# EAGLE design Twatch v1a (EAGLE 5.07)
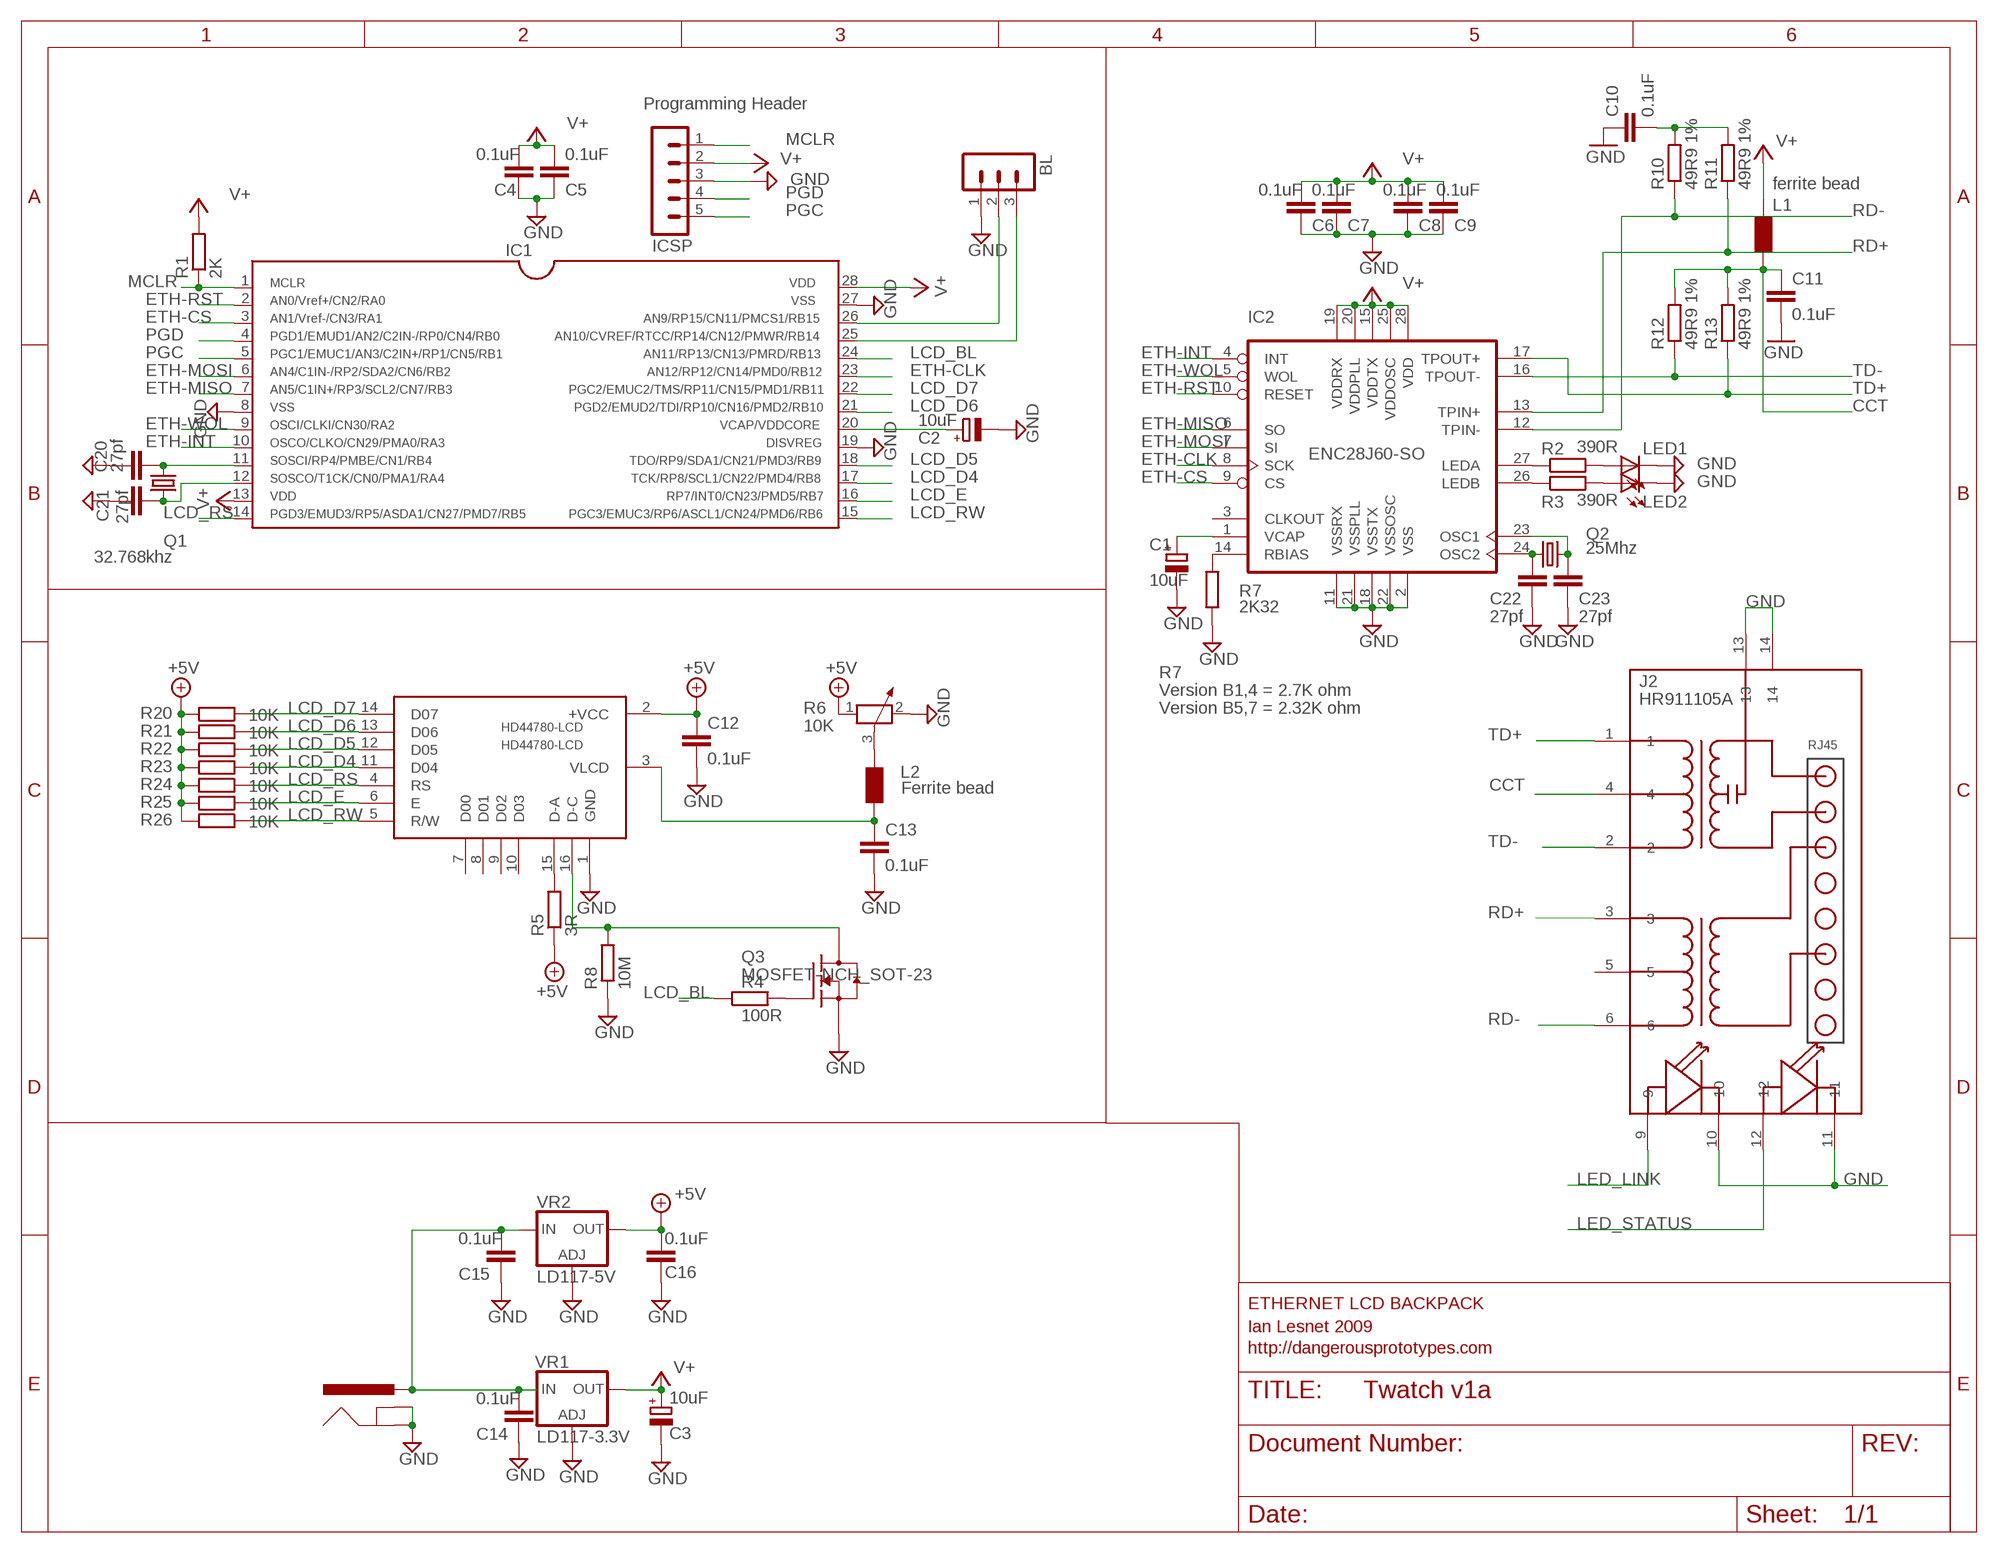
[diagram p0: schematic, sheet 1]

## Parts
BL  MA03-1  [MA03-1]
C1  10uF  CPOL-EUSMCA  [SMC_A]
C2  10uF  CPOL-EUSMCA  [SMC_A]
C3  10uF  CPOL-EUSMCA  [SMC_A]
C4  0.1uF  C-EUC0805  [C0805]
C5  0.1uF  C-EUC0805  [C0805]
C6  0.1uF  C-EUC0805  [C0805]
C7  0.1uF  C-EUC0805  [C0805]
C8  0.1uF  C-EUC0805  [C0805]
C9  0.1uF  C-EUC0805  [C0805]
C10  0.1uF  C-EUC0805  [C0805]
C11  0.1uF  C-EUC0805  [C0805]
C12  0.1uF  C-EUC0805  [C0805]
C13  0.1uF  C-EUC0805  [C0805]
C14  0.1uF  C-EUC0805  [C0805]
C15  0.1uF  C-EUC0805  [C0805]
C16  0.1uF  C-EUC0805  [C0805]
C20  27pf  C-EUC0805  [C0805]
C21  27pf  C-EUC0805  [C0805]
C22  27pf  C-EUC0805  [C0805]
C23  27pf  C-EUC0805  [C0805]
HD44780-LCD  HD44780-LCD  [HD44780]
IC1  PIC24FJ64GA002  [SO28W]
IC2  ENC28J60-SO  [SO28W]
ICSP  MA05-1  [MA05-1]
J1  POWER_JACKSMD  [POWER_JACK_SMD]
J2  HR911105A  [HR911105A]
L1  ferrite bead  WE-KIL_0805  [WE-KI_0805_B]
L2  Ferrite bead  WE-KIL_0805  [WE-KI_0805_B]
LED1  LEDCHIPLED_0805  [LED0805]
LED2  LEDCHIPLED_0805  [LED0805]
Q1  32.768khz  CRYSTALMM20SS  [MM20SS]
Q2  25Mhz  CRYSTALHC49UP  [HC49UP]
Q3  MOSFET-NCH_SOT-23  [SOT95P280X135-3N]
R1  2K  R-EU_R0805  [R0805]
R2  390R  R-EU_R0805  [R0805]
R3  390R  R-EU_R0805  [R0805]
R4  100R  R-EU_R0805  [R0805]
R5  3R  R-EU_R0805  [R0805]
R6  10K  POTENTIOMETER_PT-10  [PT-10]
R7  2K32  R-EU_R0805  [R0805]
R8  10M  R-EU_R0805  [R0805]
R10  49R9 1%  R-EU_R0805  [R0805]
R11  49R9 1%  R-EU_R0805  [R0805]
R12  49R9 1%  R-EU_R0805  [R0805]
R13  49R9 1%  R-EU_R0805  [R0805]
R20  10K  R-EU_R0805  [R0805]
R21  10K  R-EU_R0805  [R0805]
R22  10K  R-EU_R0805  [R0805]
R23  10K  R-EU_R0805  [R0805]
R24  10K  R-EU_R0805  [R0805]
R25  10K  R-EU_R0805  [R0805]
R26  10K  R-EU_R0805  [R0805]
VR1  LD117-3.3V  LD117AS12TR  [SOT223]
VR2  LD117-5V  LD117AS12TR  [SOT223]

## Nets
+5V: C12.1 C16.1 HD44780-LCD.2(+VCC) R5.1 R6.1 R20.2 R21.2 R22.2 R23.2 R24.2 R25.2 R26.2 VR2.4(OUT)
CCT: C11.1 J2.4 L1.2 R12.2 R13.2
ETH-CLK: IC1.23 IC2.8(SCK)
ETH-CS: IC1.3 IC2.9(CS)
ETH-INT: IC1.10 IC2.4(INT)
ETH-MISO: IC1.7 IC2.6(SO)
ETH-MOSI: IC1.6 IC2.7(SI)
ETH-RST: IC1.2 IC2.10(RESET)
ETH-WOL: IC1.9 IC2.5(WOL)
GND: BL.1 C1.- C2.- C3.- C4.2 C5.2 C6.2 C7.2 C8.2 C9.2 C10.1 C11.2 C12.2 C13.2 C14.2 C15.2 C16.2 C20.2 C21.2 C22.2 C23.2 HD44780-LCD.1(GND) IC1.8 IC1.19 IC1.27 IC2.2(VSS) IC2.11(VSSRX) IC2.18(VSSTX) IC2.21(VSSPLL) IC2.22(VSSOSC) ICSP.3 J1.GND(GNDBREAK) J1.P$4(GND) J2.10 J2.11 J2.13 J2.14 LED1.C LED2.C Q3.2(S) R6.2 R7.1 R8.1 VR1.1(ADJ) VR2.1(ADJ)
LCD_BL: IC1.24 R4.1
LCD_D4: HD44780-LCD.11(D04) IC1.17 R23.1
LCD_D5: HD44780-LCD.12(D05) IC1.18 R22.1
LCD_D6: HD44780-LCD.13(D06) IC1.21 R21.1
LCD_D7: HD44780-LCD.14(D07) IC1.22 R20.1
LCD_E: HD44780-LCD.6(E) IC1.16 R25.1
LCD_RS: HD44780-LCD.4(RS) IC1.14 R24.1
LCD_RW: HD44780-LCD.5(R/W) IC1.15 R26.1
LED_LINK: J2.9
LED_STATUS: J2.12
MCLR: IC1.1 ICSP.1 R1.1
N$1: C21.1 IC1.12 Q1.4
N$2: IC2.27(LEDA) R2.1
N$3: LED1.A R2.2
N$4: IC2.26(LEDB) R3.1
N$5: C20.1 IC1.11 Q1.1
N$6: C1.+ IC2.1(VCAP)
N$7: IC2.14(RBIAS) R7.2
N$8: C2.+ IC1.20
N$9: C22.1 IC2.24(OSC2) Q2.1
N$11: L2.1 R6.3
N$12: C23.1 IC2.23(OSC1) Q2.2
N$13: LED2.A R3.2
N$14: BL.2 IC1.26
N$15: BL.3 IC1.25
N$17: C13.1 HD44780-LCD.3(VLCD) L2.2
N$18: HD44780-LCD.15(D-A) R5.2
N$19: Q3.1(G) R4.2
N$20: HD44780-LCD.16(D-C) Q3.3(D) R8.2
N$22: C10.2 R10.2 R11.2
PGC: IC1.5 ICSP.5
PGD: IC1.4 ICSP.4
RD+: IC2.13(TPIN+) J2.3 R11.1
RD-: IC2.12(TPIN-) J2.6 R10.1
TD+: IC2.17(TPOUT+) J2.1 R13.1
TD-: IC2.16(TPOUT-) J2.2 R12.1
V+: C3.+ C4.1 C5.1 C6.1 C7.1 C8.1 C9.1 IC1.13 IC1.28 IC2.15(VDDTX) IC2.19(VDDRX) IC2.20(VDDPLL) IC2.25(VDDOSC) IC2.28(VDD) ICSP.2 L1.1 R1.2 VR1.4(OUT)
VBAT: C14.1 C15.1 J1.VIN0(PWR) VR1.3(IN) VR2.3(IN)
Unconnected: HD44780-LCD.7(D00) HD44780-LCD.8(D01) HD44780-LCD.9(D02) HD44780-LCD.10(D03) IC2.3(CLKOUT) J2.5

## Notes on the sheet
- Programming Header
- R7
- Version B1,4 = 2.7K ohm
- Version B5,7 = 2.32K ohm
- ETHERNET LCD BACKPACK
- Ian Lesnet 2009
- http://dangerousprototypes.com

## Library data of the parts
BL = con-lstb:MA03-1: PIN HEADER
C1-C3 = rcl:CPOL-EU: POLARIZED CAPACITOR, European symbol
C4-C16 C20-C23 = rcl:C-EU: CAPACITOR, European symbol
HD44780-LCD = lcd-hd44780:HD44780-LCD
IC1 = microchip-pic24:PIC24FJ64GA002
IC2 = microchip-enc28j60:ENC28J60-*: Microchip 10Mbit Eth. contoller with SPI interface
ICSP = con-lstb:MA05-1: PIN HEADER
J1 = SparkFun:POWER_JACK: Power Jack This is the standard 5.5mm barrel jack for power. The PTH is the most common, proven, reliable, footprint. All others are experimental. The Slot footprint only works if the mill layer is transmitted to the PCB fab house so be warned. Spark Fun Electronics SKU : PRT-00119. Mating wall wart : TOL-00298 (and others)
J2 = CONNECTER:HR911105A
L1 L2 = wuerth-elektronik:WE-KIL: SMD Wire Wound Ceramic Inductor WE-KIL - Low profile - High Q values -- Bluetooth -- Wireless LAN -- RF oscillation circuit -- IF impedance matching
LED1 LED2 = led:LED: LED OSRAM: - CHIPLED LG R971, LG N971, LY N971, LG Q971, LY Q971, LO R971, LY R971 LH N974, LH R974 LS Q976, LO Q976, LY Q976 LO Q996 - Hyper CHIPLED LW Q18S LB Q993, LB Q99A, LB R99A - SideLED LS A670, LO A670, LY A670, LG A670, LP A670 LB A673, LV A673, LT A673, LW A673 LH A674 LY A675 LS A676, LA A676, LO A676, LY A676, LW A676 LS A679, LY A679, LG A679 - Hyper Micro SIDELED® LS Y876, LA Y876, LO Y876, LY Y876 LT Y87S - SmartLED LW L88C, LW L88S LB L89C, LB L89S, LG L890 LS L89K, LO L89K, LY L89K LS L896, LA L896, LO L896, LY L896 - TOPLED LS T670, LO T670, LY T670, LG T670, LP T670 LSG T670, LSP T670, LSY T670, LOP T670, LYG T670 LG T671, LOG T671, LSG T671 LB T673, LV T673, LT T673, LW T673 LH T674 LS T676, LA T676, LO T676, LY T676, LB T676, LH T676, LSB T676, LW T676 LB T67C, LV T67C, LT T67C, LS T67K, LO T67K, LY T67K, LW E67C LS E67B, LA E67B, LO E67B, LY E67B, LB E67C, LV E67C, LT E67C LW T67C LS T679, LY T679, LG T679 LS T770, LO T770, LY T770, LG T770, LP T770 LB T773, LV T773, LT T773, LW T773 LH T774 LS E675, LA E675, LY E675, LS T675 LS T776, LA T776, LO T776, LY T776, LB T776 LHGB T686 LT T68C, LB T68C - Hyper Mini TOPLED® LB M676 - Mini TOPLED Santana® LG M470 LS M47K, LO M47K, LY M47K Source: http://www.osram.convergy.de - LUMILED® LXK2-PW12-R00, LXK2-PW12-S00, LXK2-PW14-U00, LXK2-PW14-V00 LXK2-PM12-R00, LXK2-PM12-S00, LXK2-PM14-U00 LXK2-PE12-Q00, LXK2-PE12-R00, LXK2-PE12-S00, LXK2-PE14-T00, LXK2-PE14-U00 LXK2-PB12-K00, LXK2-PB12-L00, LXK2-PB12-M00, LXK2-PB14-N00, LXK2-PB14-P00, LXK2-PB14-Q00 LXK2-PR12-L00, LXK2-PR12-M00, LXK2-PR14-Q00, LXK2-PR14-R00 LXK2-PD12-Q00, LXK2-PD12-R00, LXK2-PD12-S00 LXK2-PH12-R00, LXK2-PH12-S00 LXK2-PL12-P00, LXK2-PL12-Q00, LXK2-PL12-R00 Source: www.luxeon.com
Q1 Q2 = crystal:CRYSTAL: CRYSTAL
Q3 = ipc-7351-transistor:MOSFET-NCH_
R1-R5 R7 R8 R10-R13 R20-R26 = rcl:R-EU_: RESISTOR, European symbol
R6 = rcl:POTENTIOMETER_: Potentiometer
VR1 VR2 = v-reg:LD117A?*: Low drop fixed and adjustable positive voltage regulators 1 A Source: http://www.st.com/stonline/products/literature/ds/7194/ld1117axx.pdf

## Board
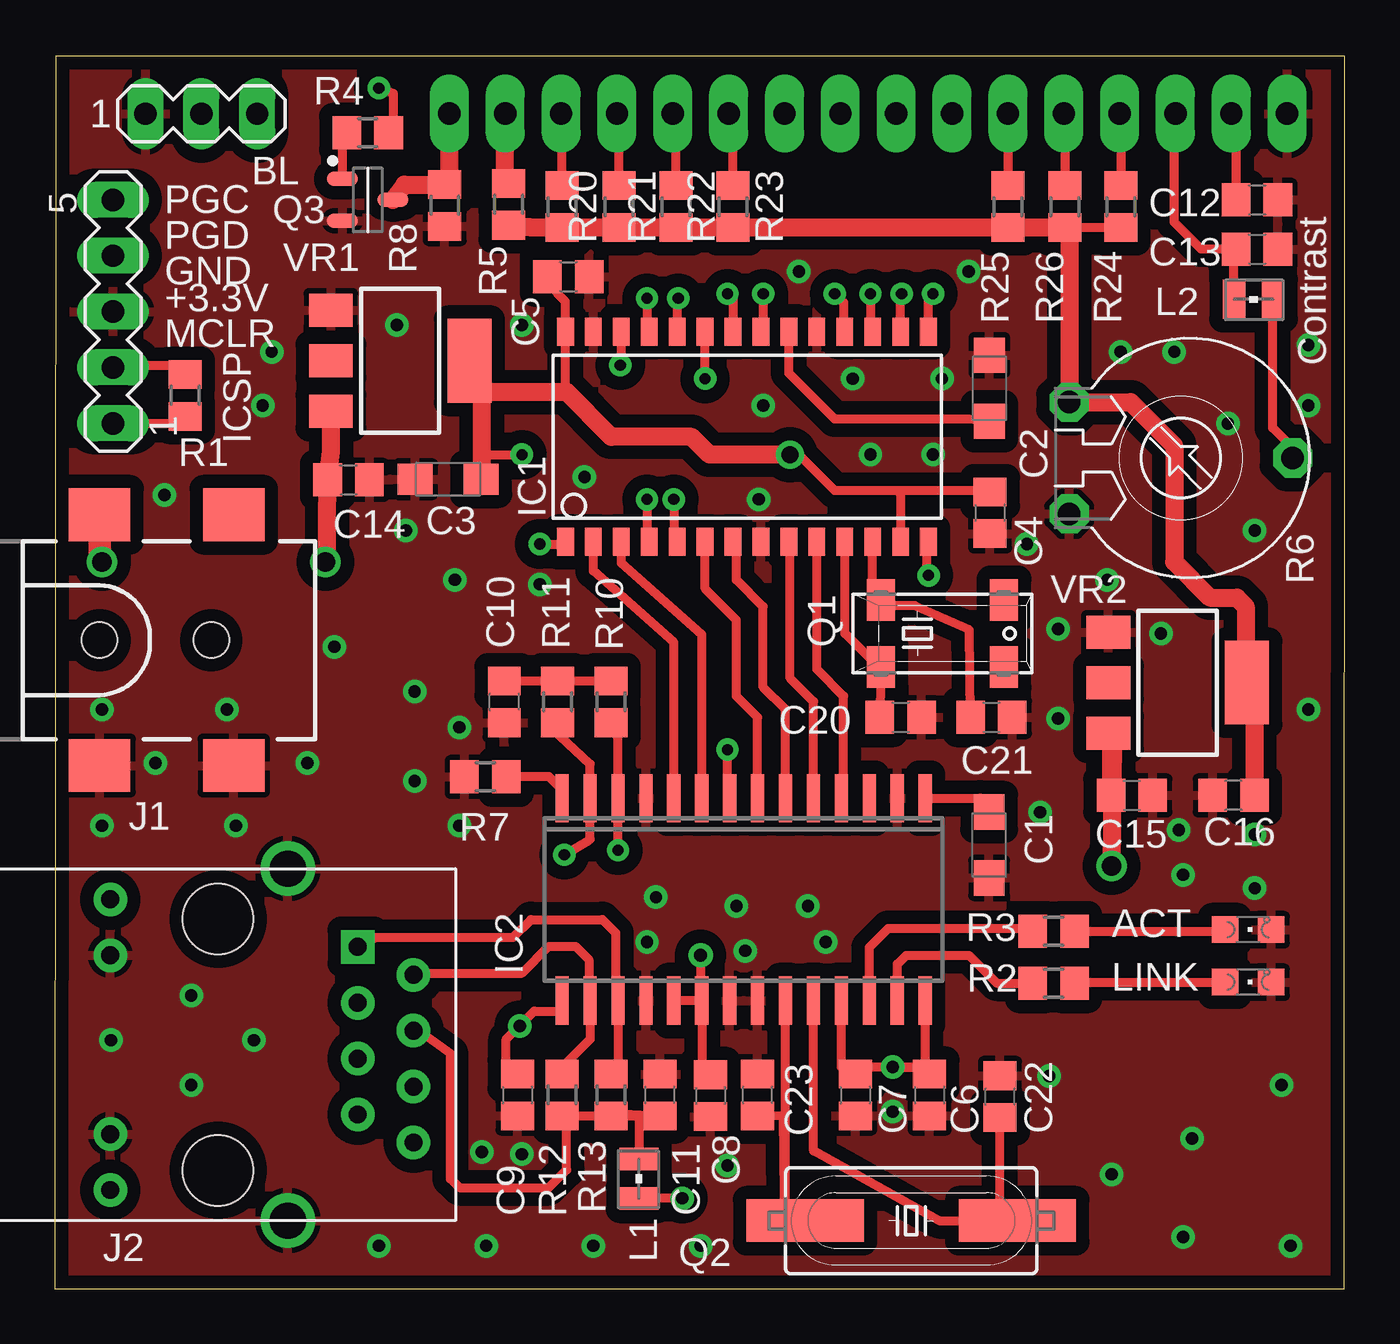
[diagram p1: board, top side]
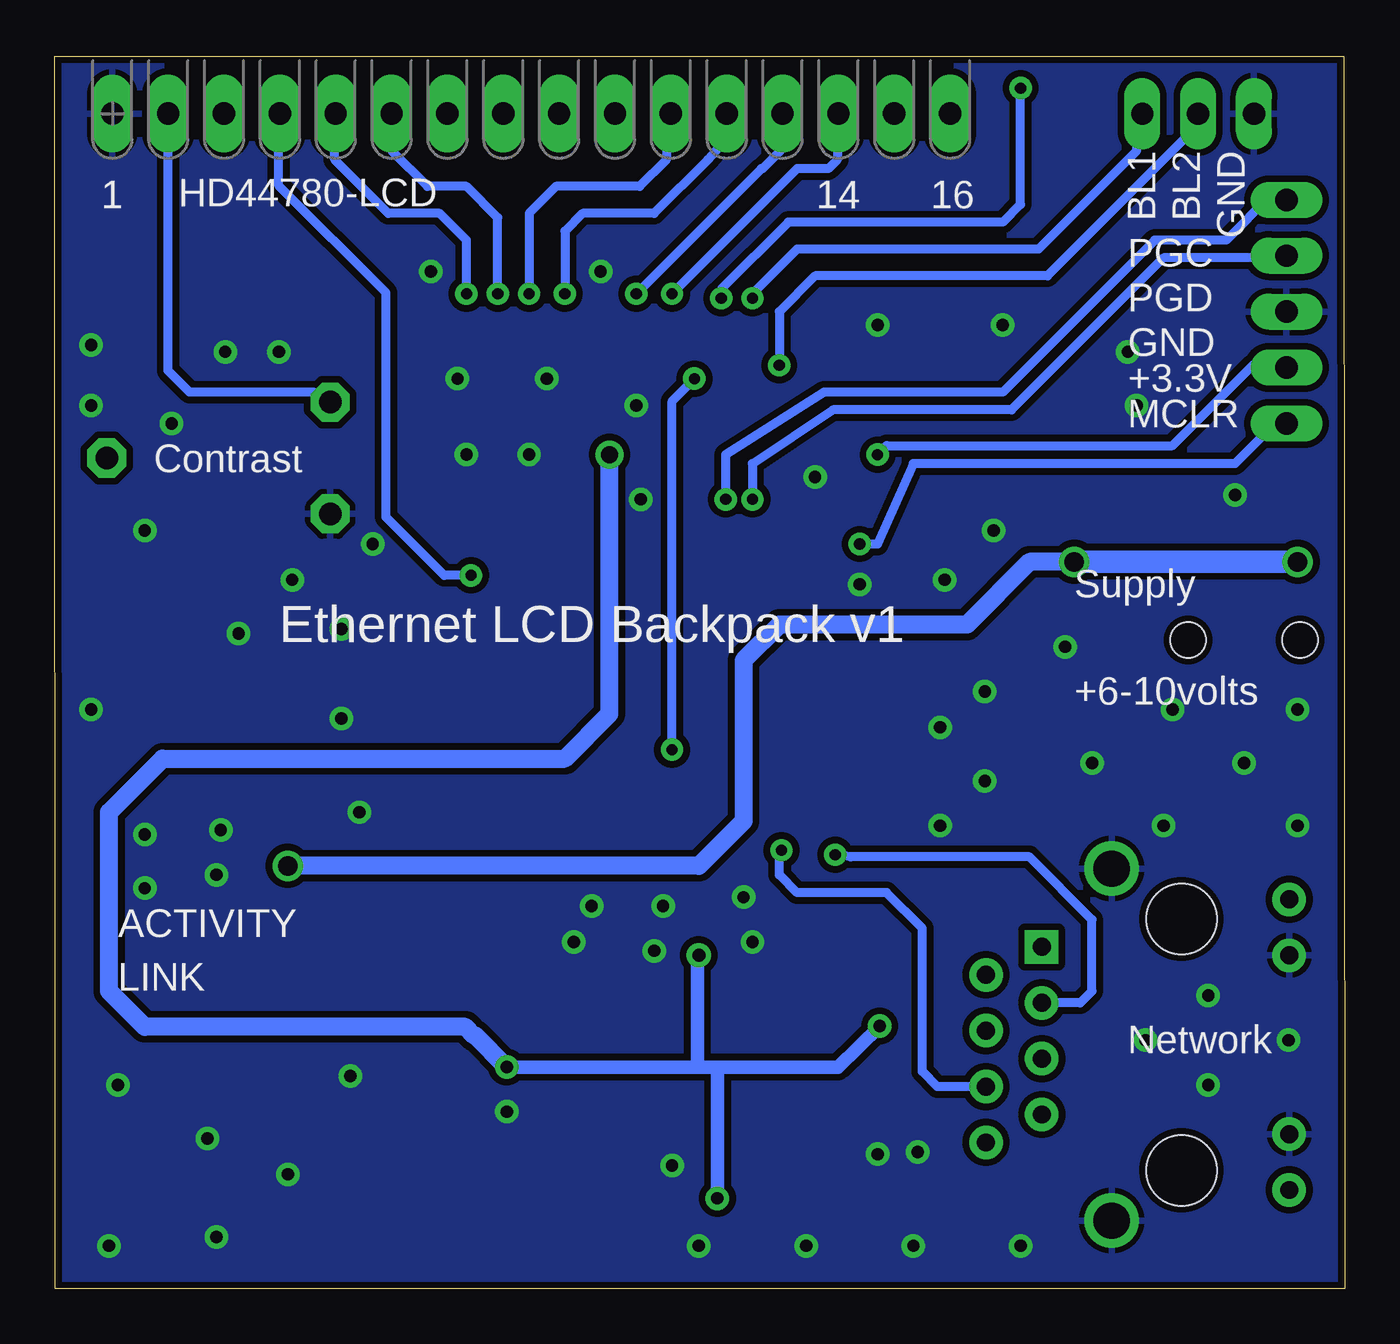
[diagram p2: board, bottom side, seen from below]

Size 58.64 x 56.02 mm. Coordinates in mm from the lower left corner, seen from the top.
Outline: 0,0 58.64,0 58.64,56.02 0.04,56.02 0,0
Copper layers (1*16): Top 0.035mm / dielectric 1.5mm / Bottom 0.035mm
Design rules "SparkFun": minimum track width 8mil, minimum drill 20mil, track to track 8mil, track to pad 8mil, pad to pad 8mil, via to via 8mil, smd to smd 8mil, copper to edge 10mil, drill to drill 8mil, minimum pad ring 12mil, minimum via ring 10mil, stop-mask expansion 4mil, vias tented up to drill 25mil, thermal gap 10mil

### Footprints (pad centres in the part's own frame; a part is rotated, then mirrored left to right if it is on the bottom)
MA03-1 = drill 1.016 long: 1 -2.54,0; 2 0,0; 3 2.54,0
SMC_A = smd 1.6 x 1.4: + -1.5,0; - 1.5,0
C0805 = smd 1.3 x 1.5: 1 -0.95,0; 2 0.95,0
HD44780 = drill 1.016 pad 1.778 long: 1 -20.325,0.007; 2 -17.785,0.007; 3 -15.245,0.007; 4 -12.705,0.007; 5 -10.165,0.007; 6 -7.625,0.007; 7 -5.085,0.007; 8 -2.545,0.007; 9 -0.005,0.007; 10 2.535,0.007; 11 5.075,0.007; 12 7.615,0.007; 13 10.155,0.007; 14 12.695,0.007; 15 15.235,0.007; 16 17.775,0.007
SO28W = smd 0.762 x 1.27: 1 -8.89,-4.78; 2 -7.62,-4.78; 3 -6.35,-4.78; 4 -5.08,-4.78; 5 -3.81,-4.78; 6 -2.54,-4.78; 7 -1.27,-4.78; 8 0,-4.78; 9 1.27,-4.78; 10 2.54,-4.78; 11 3.81,-4.78; 12 5.08,-4.78; 13 6.35,-4.78; 14 7.62,-4.78; 15 7.62,4.78; 16 6.35,4.78; 17 5.08,4.78; 18 3.81,4.78; 19 2.54,4.78; 20 1.27,4.78; 21 0,4.78; 22 -1.27,4.78; 23 -2.54,4.78; 24 -3.81,4.78; 25 -5.08,4.78; 26 -6.35,4.78; 27 -7.62,4.78; 28 -8.89,4.78
SO28W' = smd 0.6 x 2.2: 1 -8.255,-4.6; 2 -6.985,-4.6; 3 -5.715,-4.6; 4 -4.445,-4.6; 5 -3.175,-4.6; 6 -1.905,-4.6; 7 -0.635,-4.6; 8 0.635,-4.6; 9 1.905,-4.6; 10 3.175,-4.6; 11 4.445,-4.6; 12 5.715,-4.6; 13 6.985,-4.6; 14 8.255,-4.6; 15 8.255,4.6; 16 6.985,4.6; 17 5.715,4.6; 18 4.445,4.6; 19 3.175,4.6; 20 1.905,4.6; 21 0.635,4.6; 22 -0.635,4.6; 23 -1.905,4.6; 24 -3.175,4.6; 25 -4.445,4.6; 26 -5.715,4.6; 27 -6.985,4.6; 28 -8.255,4.6
MA05-1 = drill 1.016 long: 1 -5.08,0; 2 -2.54,0; 3 0,0; 4 2.54,0; 5 5.08,0
POWER_JACK_SMD = smd 2.8 x 2.4: GND 0,-5.7; P$4 6.1,-5.7; VIN0 0,5.7; VIN1 6.1,5.7 | hole 1.6: 0,0; 5.08,0
HR911105A = drill 0.813 pad 1.524 square: 1 4.445,-6.35 | drill 0.813 pad 1.524 round: 2 3.175,-8.89; 3 1.905,-6.35; 4 0.635,-8.89; 5 -0.635,-6.35; 6 -1.905,-8.89; 7 -3.175,-6.35; 8 -4.445,-8.89; 9 6.604,4.902; 10 4.064,4.902; 11 -4.064,4.902; 12 -6.604,4.902 | drill 1.651 pad 2.159 round: 13 8.001,-3.175; 14 -8.001,-3.175 | hole 3.2: 5.715,0; -5.715,0
WE-KI_0805_B = smd 1.02 x 1.78: 1 -0.89,0; 2 0.89,0
LED0805 = smd 1.2 x 1.2: A 0,-1.05; C 0,1.05
MM20SS = smd 1.27 x 1.88: 1 -2.794,-1.524; 2 2.794,-1.524; 3 2.794,1.524; 4 -2.794,1.524
HC49UP = smd 5.334 x 1.93: 1 -4.826,0; 2 4.826,0
SOT95P280X135-3N = smd 1.4 x 0.65: 1 -1.15,0.95; 2 -1.15,-0.95; 3 1.15,0
R0805 = smd 1.3 x 1.5: 1 -0.95,0; 2 0.95,0
PT-10 = drill 1.016 pad 1.778 octagon: 1 -2.54,-5.08; 2 2.54,-5.08; 3 0,5.08
SOT223 = smd 1.5 x 2: 1 -2.3,-3.15; 2 0,-3.15; 3 2.3,-3.15 | smd 3.8 x 2: 4 0,3.15

### Placement (x,y rotation side)
BL  6.65,53.41 0 top
C1  42.48,20.18 270 top
C2  42.49,40.94 90 top
C3  17.88,36.8 180 top
C4  42.52,35.28 270 top
C5  23.34,46.01 0 top
C6  39.78,8.81 270 top
C7  36.4,8.81 270 top
C8  29.81,8.78 270 top
C9  21.03,8.81 270 top
C10  20.43,26.68 90 top
C11  27.51,8.81 90 top
C12  54.66,49.5 0 top
C13  54.66,47.26 0 top
C14  13.35,36.77 0 top
C15  48.97,22.42 0 top
C16  53.59,22.42 180 top
C20  38.46,25.98 0 top
C21  42.58,25.98 0 top
C22  42.98,8.73 90 top
C23  31.95,8.81 90 top
HD44780-LCD  35.71,53.41 0 bottom
IC1  32.11,38.73 0 top
IC2  ENC28J60-SO  [SO28W']  31.32,17.7 180 top
ICSP  2.64,44.42 90 top
J1  2.03,29.48 0 top
J2  7.42,11.09 90 top
L1  26.56,5 90 top
L2  54.51,44.98 180 top
LED1  54.25,13.94 270 top
LED2  54.25,16.33 270 top
Q1  40.36,29.79 0 top
Q2  38.94,3.09 180 top
Q3  14.22,49.5 0 top
R1  5.92,40.61 90 top
R2  45.42,13.89 0 top
R3  45.42,16.25 0 top
R4  14.22,52.55 180 top
R5  20.62,49.3 90 top
R6  51.21,37.76 270 top
R7  19.57,23.27 0 top
R8  17.73,49.25 90 top
R10  25.29,26.68 90 top
R11  22.86,26.68 90 top
R12  23.06,8.81 270 top
R13  25.29,8.81 270 top
R20  23.06,49.19 270 top
R21  25.65,49.19 270 top
R22  28.24,49.19 270 top
R23  30.84,49.19 270 top
R24  48.46,49.19 270 top
R25  43.33,49.19 270 top
R26  45.92,49.19 270 top
VR1  15.7,42.18 270 top
VR2  51.05,27.55 270 top

### Tracks (layer width: path | path; a pad name or v marks a point on that pad's centre or on a via)
+5V
  Top 0.406: R24.2 R26.2 46.13,48.04 | 53.5,49.31 C12.1 53.71,53.2 HD44780-LCD.2 | 54.41,27.35 VR2.4 54.54,27.21
  Top 0.61: R5.1 21.64,48.35 21.64,48.24
  Top 0.813: R26.2 R25.2 R23.2 R22.2 R21.2 R20.2 21.64,48.24 21.07,48.24 | 54.54,27.21 C16.1 | 46.13,48.04 R6.1 48.92,40.3 50.9,38.32 50.9,33.04 52.53,31.41 53.75,31.41 54.15,31.01 54.15,27.61 VR2.4
  Bottom 0.406: HD44780-LCD.2 53.5,41.73 52.53,40.76 46.89,40.76 46.84,40.71 R6.1
CCT
  Top 0.406: 26.56,7.86 27.72,7.75 | 26.56,7.86 L1.2 | R13.2 26.56,7.86 | R13.2 25.6,8.17 25.82,7.96 C11.1 | R13.2 23.38,7.86 23.06,7.54 R12.2 23.27,7.66 23.27,5.4 22.45,4.59 18.39,4.59 17.98,5 17.98,10.69 16.54,11.73 J2.4
ETH-CLK  (via drill 0.51)
  Top 0.406: v29.57,41.37 IC1.23 | v30.58,24.51 30.58,22.2 IC2.8
  Bottom 0.406: v30.58,24.51 30.58,40.36 v29.57,41.37
ETH-CS
  Top 0.406: IC1.3 25.76,32.99 29.41,29.74 IC2.9
ETH-INT
  Top 0.406: IC1.10 34.65,28.16 35.87,26.94 35.87,22.4 IC2.4
ETH-MISO
  Top 0.406: IC2.6 33.22,26.34 32.21,27.35 32.21,31.01 30.99,32.23 30.99,33.8 IC1.7
ETH-MOSI
  Top 0.406: IC2.7 31.95,25.98 30.99,26.94 30.99,30.4 29.57,31.82 IC1.6
ETH-RST
  Top 0.406: IC2.10 28.14,29.38 24.49,32.63 IC1.2
ETH-WOL
  Top 0.406: IC2.5 34.49,26.69 33.43,27.76 33.43,33.9 IC1.9
GND  (via drill 0.56)
  other vias: 21.23,6.12 26.92,15.77 31.39,15.36 27.33,17.8 30.58,5.61 38.1,8.05 45.21,9.67 36.27,41.37 19.41,6.22 19.61,1.95 4.57,23.9 2.13,21.05 11.48,23.9 2.13,26.33 7.82,26.33 12.7,29.18 8.23,21.05 30.99,17.39 34.24,17.39 54.56,18.21 54.56,20.65 24.49,1.95 29.36,1.95 14.73,1.95 50.29,29.79 45.62,25.93 35.05,15.77 45.62,29.99 51.1,20.85 16.36,23.08 18.39,25.52 40.34,41.37 39.93,37.92 37.08,37.92 32.21,40.15 32,35.89 18.19,32.23 57,40.15 57,42.9 47.85,32.23 15.95,34.46 22.05,32.02 9.45,40.15 57,26.33 53.34,39.34 48.46,42.59 50.9,42.59 6.2,13.33 6.2,9.27 2.54,11.3 9.04,11.3 16.36,27.15 41.55,46.25 44.2,33.85 33.83,46.25 51.31,18.82 44.81,21.66 4.98,36.09 9.86,42.59 15.54,43.81 21.23,43.81 56.18,1.95 51.71,6.83 55.78,9.27 51.31,2.36 48.06,5.2 54.56,34.46 18.39,21.05 24.08,36.9
  pour Top (isolate 0.61): 0.1,55.8 58.47,56.21 58.47,-0.13 0.1,-0.13
  pour Bottom (isolate 0.305): 0.1,56.26 58.47,56.26 58.47,-0.13 0.1,-0.13
LCD_BL  (via drill 0.51)
  Top 0.406: IC1.24 28.3,44.98 v28.35,45.03 | R4.1 15.38,52.71 15.38,54.34 v14.73,54.58
  Bottom 0.406: v28.35,45.03 28.35,45.44 25.3,48.48 15.55,48.48 14.73,49.3 v14.73,54.58
LCD_D4  (via drill 0.51)
  Top 0.406: v37.08,45.23 37.08,43.61 IC1.17 | R23.1 30.84,53.22 HD44780-LCD.11
  Bottom 0.406: v37.08,45.23 37.08,48.89 35.87,50.11 32.06,50.11 30.84,51.33 30.84,53.22 HD44780-LCD.11
LCD_D5  (via drill 0.51)
  Top 0.406: v35.46,45.23 35.87,44.83 35.87,43.56 IC1.18 | R22.1 28.25,53.27 HD44780-LCD.12
  Bottom 0.406: v35.46,45.23 35.46,48.08 34.65,48.89 31.39,48.89 28.96,51.33 28.14,52.24 28.25,52.14 28.25,53.27 HD44780-LCD.12
LCD_D6  (via drill 0.51)
  Top 0.406: v32.21,45.23 32.21,43.61 IC1.21 | R21.1 25.65,53.32 HD44780-LCD.13
  Bottom 0.406: v32.21,45.23 26.52,50.92 26.47,50.92 25.65,51.73 25.65,53.32 HD44780-LCD.13
LCD_D7  (via drill 0.51)
  Top 0.406: IC1.22 30.84,44.98 v30.58,45.23 | R20.1 23.06,52.75 22.86,52.95 22.86,53.26 HD44780-LCD.14
  Bottom 0.406: 22.86,53.26 HD44780-LCD.14 23.06,53.37 23.06,51.33 23.47,50.92 24.89,50.92 v30.58,45.23
LCD_E  (via drill 0.51)
  Top 0.406: R25.1 HD44780-LCD.6 | IC1.16 38.46,45.08 v38.51,45.23
  Bottom 0.406: v38.51,45.23 38.51,48.69 39.93,50.11 41.71,50.11 43.33,51.73 HD44780-LCD.6
LCD_RS  (via drill 0.51)
  Top 0.406: R24.1 48.46,53.37 HD44780-LCD.4 | IC1.14 39.63,33.95 39.63,32.53 v39.73,32.43
  Bottom 0.406: v39.73,32.43 40.95,32.43 43.59,35.07 43.59,45.27 R24.1 48.46,53.37 HD44780-LCD.4
LCD_RW  (via drill 0.51)
  Top 0.406: R26.1 45.92,53.37 HD44780-LCD.5 | IC1.15 39.73,45.03 v39.93,45.23
  Bottom 0.406: v39.93,45.23 39.93,47.67 41.15,48.89 43.49,48.89 45.92,51.33 45.92,53.37 HD44780-LCD.5
MCLR  (via drill 0.51)
  Top 0.406: ICSP.1 6.01,39.34 R1.1 | IC1.1 23.12,33.85 v22.05,33.85
  Bottom 0.406: v22.05,33.85 21.23,33.85 19.61,37.51 4.98,37.51 2.95,39.54 2.85,39.54 ICSP.1
N$1
  Top 0.406: C21.1 41.58,29.95 39.09,31.06 37.82,31.06 Q1.4 37.44,31.31 37.19,31.06 IC1.12
N$2
  Top 0.406: R2.1 42.82,13.89 41.55,15.16 38.71,15.16 38.3,14.75 IC2.27
N$3
  Top 0.406: LED1.A 46.42,13.94 R2.2
N$4
  Top 0.406: 37.03,12.62 IC2.26 37.03,15.51 37.9,16.38 44.34,16.38 R3.1
N$5
  Top 0.406: 37.61,28.3 Q1.1 37.44,28.27 35.92,29.79 IC1.11 | C20.1 37.61,28.3 | 37.61,28.3 37.82,28.52
N$6
  Top 0.406: IC2.1 42.06,22.3 C1.+
N$7
  Top 0.406: IC2.14 23.06,22.68 22.45,23.29 20.53,23.29 R7.2
N$8
  Top 0.406: 33.38,43.81 IC1.20 33.38,41.63 35.46,39.54 41.58,39.54 C2.+
N$9
  Top 0.406: IC2.24 34.49,6.27 40.21,3.09 | 40.21,3.09 42.11,3.09 | 40.21,3.09 43.18,3.09 | 43.18,3.09 Q2.1 45.92,3.09 43.59,2.82 43.69,3.17 43.05,3.71 | C22.1 42.98,3.3 43.18,3.09
N$11
  Top 0.406: R6.3 56.29,38.22 55.37,39.14 55.37,45.36 L2.1
N$12
  Top 0.406: 32.99,2.93 Q2.2 | 32.99,2.93 34.49,3.73 | C23.1 33.13,7.85 33.19,2.46 | 33.19,2.46 32.99,2.93 | IC2.23 33.22,2.46 33.19,2.46
N$13
  Top 0.406: R3.2 53.13,16.25 LED2.A
N$14  (via drill 0.51)
  Top 0.406: IC1.26 25.76,42.03 v25.71,41.98
  Bottom 0.406: v25.71,41.98 25.71,44.42 24.08,46.05 13.51,46.05 6.6,52.95 6.6,53.56 BL.2
N$15  (via drill 0.51)
  Top 0.406: IC1.25 26.92,43.51 v26.92,45.03
  Bottom 0.406: v26.92,45.03 26.92,45.23 24.89,47.26 13.92,47.26 9.45,51.73 9.45,53.36 BL.3 9.2,53.56
N$17
  Top 0.406: 51.03,53.35 HD44780-LCD.3 50.9,53.36 50.9,48.48 52.12,47.26 C13.1 53.62,47.58 L2.2
N$18
  Top 0.813: R5.2 20.48,50.25 HD44780-LCD.15
N$19
  Top 0.406: Q3.1 13.07,52.35 R4.2
N$20
  Top 0.813: HD44780-LCD.16 17.94,50.4 R8.2 15.9,50.2 Q3.3
N$22
  Top 0.406: R10.2 R11.2 C10.2
PGC  (via drill 0.51)
  Top 0.406: v28.14,35.88 28.14,34.1 IC1.5
  Bottom 0.406: ICSP.5 2.85,49.7 3.35,49.7 5.39,47.67 8.64,47.67 15.55,40.76 23.67,40.76 28.14,37.92 v28.14,35.88
PGD  (via drill 0.51)
  Top 0.406: v26.92,35.88 26.92,34.05 IC1.4
  Bottom 0.406: ICSP.4 2.74,46.86 8.23,46.86 15.14,39.95 23.27,39.95 26.92,37.51 v26.92,35.88
RD+  (via drill 0.51)
  Top 0.406: R11.1 22.66,25.42 24.33,23.85 IC2.13 24.33,20.44 24.28,20.39 v23.17,19.73
  Bottom 0.406: J2.3 12.01,13 11.48,13.53 11.48,16.78 14.33,19.63 22.45,19.63 v23.17,19.73
RD-  (via drill 0.51)
  Top 0.406: R10.1 25.6,25 25.6,23.38 IC2.12 v25.6,19.93
  Bottom 0.406: J2.6 18.52,9.19 19.2,9.88 19.2,16.38 20.83,18 24.89,18 25.71,18.82 25.71,19.83 v25.6,19.93
TD+
  Top 0.406: R13.1 25.6,10.08 IC2.17 25.5,13.2 25.5,16.18 24.89,16.78 21.64,16.78 20.83,15.97 14.61,15.97 J2.1
TD-
  Top 0.406: R12.1 23.06,10.08 24.33,11.35 IC2.16 24.28,13.15 24.28,14.96 23.67,15.57 22.45,15.57 21.23,14.35 16.79,14.35 J2.2
V+  (via drill 0.51, 0.56, 0.6, 0.76)
  Top 0.406: 35.76,10.08 IC2.25 | 39.57,10.08 IC2.28 | 35.76,10.08 C7.1 | 35.76,10.08 v38.1,10.08 39.57,10.08 | IC2.15 23.06,12.62 21.79,12.62 21.15,11.98 | 26.56,4.05 L1.1 v28.52,4.11 | 21.15,11.93 v21.14,11.94 21.16,11.95 21.15,11.98 | 20.8,9.58 20.97,9.76 C9.1 20.97,9.7 20.59,10.08 20.52,10.08 20.52,11.35 21.15,11.98 | 39.57,10.08 C6.1 | 29.41,12.99 29.42,12.98 | IC2.20 29.41,12.99 | IC2.19 29.3,13.1 29.41,12.99 | IC2.20 29.41,9.85 29.44,9.83 29.67,9.83 29.8,9.7 29.81,9.7 C8.1 | 22.9,45.19 22.86,45.23 | 22.9,45.19 C5.1 | 22.9,45.19 23.22,44.88 IC1.28 23.22,40.81 | 39.57,10.08 38.3,10.08 | v29.36,15.16 29.36,13.1 IC2.20 | 38.3,36.29 35.46,36.29 33.83,37.92 v33.43,37.92 | 38.3,36.29 42.05,36.29 C4.1 | R1.2 6.33,41.85 6.2,41.98 3.05,41.98 ICSP.2 | IC1.13 38.46,36.14 38.3,36.29 | VR1.4 19.61,42.18 19.61,37.92 v21.23,37.92
  Top 0.813: v33.43,37.92 29.77,37.92 28.96,38.73 25.3,38.73 23.22,40.81 23.17,40.76 19.41,40.76 | VR1.4 19,42.18 18.8,40.76 19.41,40.76 | VR1.4 19.38,41.65 | VR1.4 18.85,41.32 19.41,40.76 | 19.41,40.76 19.41,36.82 C3.+
  Bottom 0.406: 29.38,10.11 29.41,10.08 | 28.48,10.08 28.52,10.04 | 29.41,15.16 v29.36,15.16 | v21.23,37.92 20.83,38.32 7.82,38.32 4.17,41.98 2.74,41.98 ICSP.2
  Bottom 0.61: 29.41,10.08 v38.1,10.08 | 29.41,10.08 28.48,10.08 23.04,10.08 v21.14,11.94 | 28.52,10.04 v28.52,4.11 | 29.41,10.08 29.41,15.16
  Bottom 0.813: v33.43,37.92 33.43,26.13 35.46,24.1 53.75,24.1 56.19,21.66 56.19,13.53 54.56,11.91 39.98,11.91 39.57,11.5 39.52,11.5 v38.1,10.08
VBAT  (via drill 0.89)
  Top 0.813: C15.1 48.02,25.14 VR2.3 48.12,24.85 v48.06,19.22 | VR1.3 12.55,38.04 C14.1 12.37,34.74 12.37,33.12 v12.29,33.04
  Top 1.016: J1.VIN0 2.03,33.55 v2.13,33.04
  Bottom 0.813: v12.29,33.04 14.33,33.04 17.17,30.2 25.71,30.2 27.33,28.57 27.33,21.25 29.36,19.22 v48.06,19.22
  Bottom 1.016: v2.13,33.04 v12.29,33.04

### Text on the board
bPlace: Ethernet LCD Backpack v1
tNames: PGC | PGD | GND | +3.3V | MCLR | Contrast | J1 | ACT | LINK | Copyright 2009 Ian Lesnet | Creative Commons Attribution-Noncommercial-Share Alike 3.0 | http://dangerousprototypes.com
bNames: GND | BL2 | BL1 | PGC | PGD | GND | +3.3V | MCLR | Contrast | Supply | +6-10volts | ACTIVITY | LINK | Network
tValues: RA0 | RA1 | GND | V+ | GND | RB15 | MCLR | V+ | GND | PGD3 | PGC3